# Altium project GEM_AVD_eFuse.PrjPcb (part 4 of 4)

## Sheet Mechanics.SchDoc: GEM AVD eFuse
size 420 x 297 mm; Author: G.Kasprowicz; CompanyName: WUT ISE; DrawnBy: G.Kasprowicz; Organization: WUT ISE; Address1: PW ISE; Address2: Nowowiejska 15/19 00-665 Warsaw; Address3: gkasprow@gmail.com; Revision: 2; SheetNumber: 5; SheetTotal: 6; ModifiedBy: -; CheckedDate: -; Title2: channel connectors; DivGrp: WUT ISE; Designer: G.Kasprowicz; ModifiedDate: -; ProjectName: Sensor Box
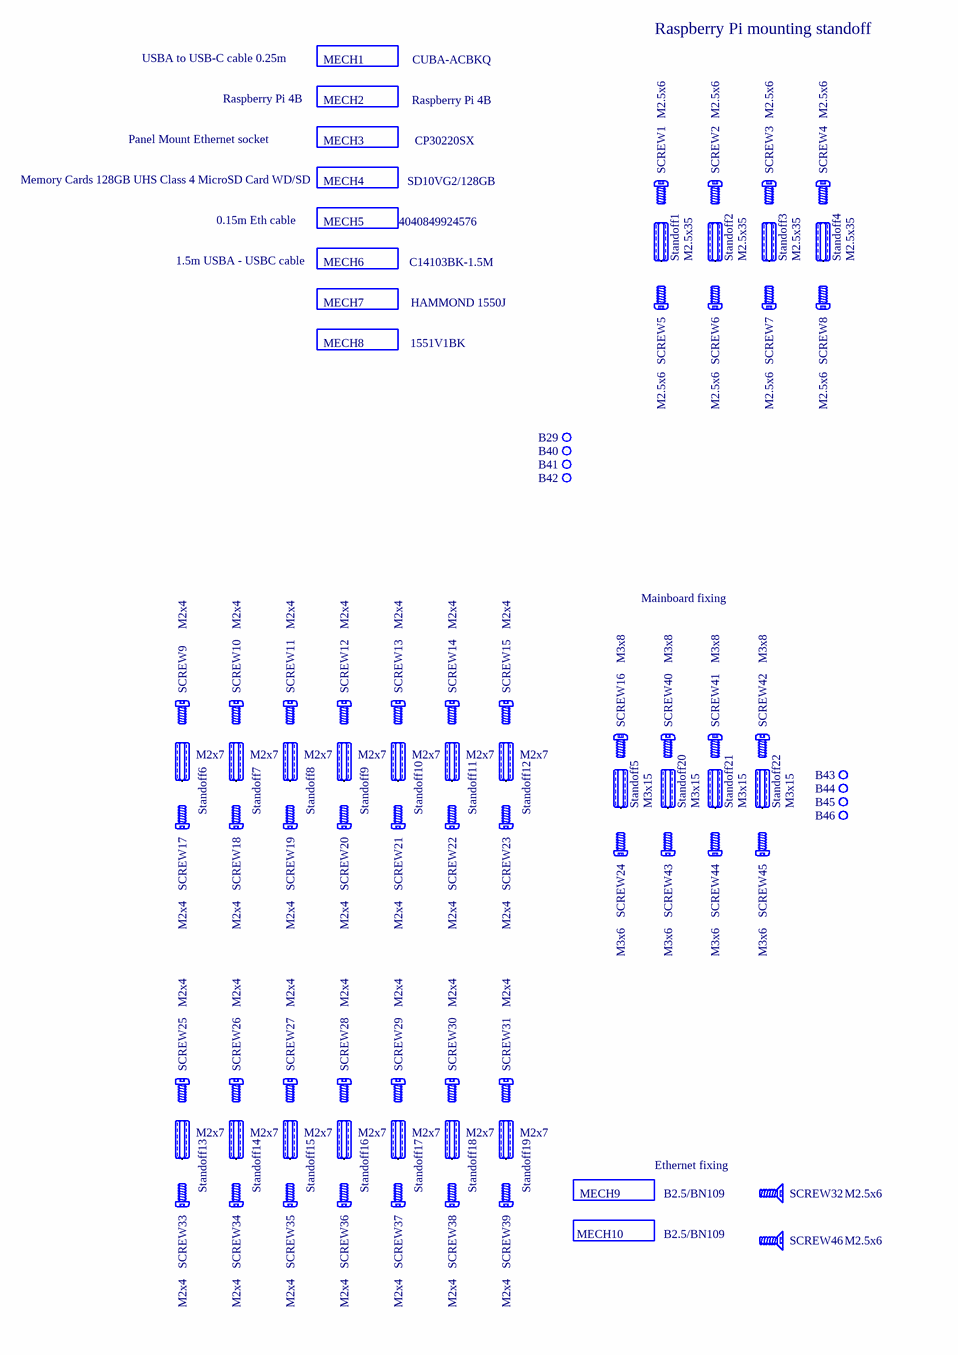
[diagram p4: Mechanics.SchDoc]

### Parts
B29  Plated Hole  [MTG300_600]  (value not drawn)  (no BOM)
B40  Plated Hole  [MTG300_600]  (value not drawn)  (no BOM)
B41  Plated Hole  [MTG300_600]  (value not drawn)  (no BOM)
B42  Plated Hole  [MTG300_600]  (value not drawn)  (no BOM)
B43  Plated Hole  [MTG320_550]  (value not drawn)  (no BOM)
B44  Plated Hole  [MTG320_550]  (value not drawn)  (no BOM)
B45  Plated Hole  [MTG320_550]  (value not drawn)  (no BOM)
B46  Plated Hole  [MTG320_550]  (value not drawn)  (no BOM)
MECH1  CUBA-ACBKQ  (mechanical)
MECH2  Raspberry Pi 4B  (mechanical)
MECH3  CP30220SX  (mechanical)
MECH4  SD10VG2/128GB  (mechanical)
MECH5  4040849924576  (mechanical)
MECH6  C14103BK-1.5M  (mechanical)
MECH7  HAMMOND 1550J  (mechanical)
MECH8  1551V1BK  (mechanical)
MECH9  B2.5/BN109  (mechanical)
MECH10  B2.5/BN109  (mechanical)
SCREW1  M2.5x6  [BOSSARD_BN9524-3271397_h]  (mechanical)
SCREW2  M2.5x6  [BOSSARD_BN9524-3271397_h]  (mechanical)
SCREW3  M2.5x6  [BOSSARD_BN9524-3271397_h]  (mechanical)
SCREW4  M2.5x6  [BOSSARD_BN9524-3271397_h]  (mechanical)
SCREW5  M2.5x6  [BOSSARD_BN9524-3271397_h]  (mechanical)
SCREW6  M2.5x6  [BOSSARD_BN9524-3271397_h]  (mechanical)
SCREW7  M2.5x6  [BOSSARD_BN9524-3271397_h]  (mechanical)
SCREW8  M2.5x6  [BOSSARD_BN9524-3271397_h]  (mechanical)
SCREW9  M2x4  [BOSSARD_BN9524-3271397_h]  (mechanical)
SCREW10  M2x4  [BOSSARD_BN9524-3271397_h]  (mechanical)
SCREW11  M2x4  [BOSSARD_BN9524-3271397_h]  (mechanical)
SCREW12  M2x4  [BOSSARD_BN9524-3271397_h]  (mechanical)
SCREW13  M2x4  [BOSSARD_BN9524-3271397_h]  (mechanical)
SCREW14  M2x4  [BOSSARD_BN9524-3271397_h]  (mechanical)
SCREW15  M2x4  [BOSSARD_BN9524-3271397_h]  (mechanical)
SCREW16  M3x8  [BOSSARD_BN9524-3271397_h]  (mechanical)
SCREW17  M2x4  [BOSSARD_BN9524-3271397_h]  (mechanical)
SCREW18  M2x4  [BOSSARD_BN9524-3271397_h]  (mechanical)
SCREW19  M2x4  [BOSSARD_BN9524-3271397_h]  (mechanical)
SCREW20  M2x4  [BOSSARD_BN9524-3271397_h]  (mechanical)
SCREW21  M2x4  [BOSSARD_BN9524-3271397_h]  (mechanical)
SCREW22  M2x4  [BOSSARD_BN9524-3271397_h]  (mechanical)
SCREW23  M2x4  [BOSSARD_BN9524-3271397_h]  (mechanical)
SCREW24  M3x6  [BOSSARD_BN9524-3271397_h]  (mechanical)
SCREW25  M2x4  [BOSSARD_BN9524-3271397_h]  (mechanical)
SCREW26  M2x4  [BOSSARD_BN9524-3271397_h]  (mechanical)
SCREW27  M2x4  [BOSSARD_BN9524-3271397_h]  (mechanical)
SCREW28  M2x4  [BOSSARD_BN9524-3271397_h]  (mechanical)
SCREW29  M2x4  [BOSSARD_BN9524-3271397_h]  (mechanical)
SCREW30  M2x4  [BOSSARD_BN9524-3271397_h]  (mechanical)
SCREW31  M2x4  [BOSSARD_BN9524-3271397_h]  (mechanical)
SCREW32  M2.5x6  [OSSARD_M3X8/BN3327_h]  (mechanical)
SCREW33  M2x4  [BOSSARD_BN9524-3271397_h]  (mechanical)
SCREW34  M2x4  [BOSSARD_BN9524-3271397_h]  (mechanical)
SCREW35  M2x4  [BOSSARD_BN9524-3271397_h]  (mechanical)
SCREW36  M2x4  [BOSSARD_BN9524-3271397_h]  (mechanical)
SCREW37  M2x4  [BOSSARD_BN9524-3271397_h]  (mechanical)
SCREW38  M2x4  [BOSSARD_BN9524-3271397_h]  (mechanical)
SCREW39  M2x4  [BOSSARD_BN9524-3271397_h]  (mechanical)
SCREW40  M3x8  [BOSSARD_BN9524-3271397_h]  (mechanical)
SCREW41  M3x8  [BOSSARD_BN9524-3271397_h]  (mechanical)
SCREW42  M3x8  [BOSSARD_BN9524-3271397_h]  (mechanical)
SCREW43  M3x6  [BOSSARD_BN9524-3271397_h]  (mechanical)
SCREW44  M3x6  [BOSSARD_BN9524-3271397_h]  (mechanical)
SCREW45  M3x6  [BOSSARD_BN9524-3271397_h]  (mechanical)
SCREW46  M2.5x6  [OSSARD_M3X8/BN3327_h]  (mechanical)
Standoff1  M2.5x35  [BOSSARD_BN3320-1382721]  (mechanical)
Standoff2  M2.5x35  [BOSSARD_BN3320-1382721]  (mechanical)
Standoff3  M2.5x35  [BOSSARD_BN3320-1382721]  (mechanical)
Standoff4  M2.5x35  [BOSSARD_BN3320-1382721]  (mechanical)
Standoff5  M3x15  [BOSSARD_BN3320-1382721]  (mechanical)
Standoff6  M2x7  [BOSSARD_BN3320-1382721]  (mechanical)
Standoff7  M2x7  [BOSSARD_BN3320-1382721]  (mechanical)
Standoff8  M2x7  [BOSSARD_BN3320-1382721]  (mechanical)
Standoff9  M2x7  [BOSSARD_BN3320-1382721]  (mechanical)
Standoff10  M2x7  [BOSSARD_BN3320-1382721]  (mechanical)
Standoff11  M2x7  [BOSSARD_BN3320-1382721]  (mechanical)
Standoff12  M2x7  [BOSSARD_BN3320-1382721]  (mechanical)
Standoff13  M2x7  [BOSSARD_BN3320-1382721]  (mechanical)
Standoff14  M2x7  [BOSSARD_BN3320-1382721]  (mechanical)
Standoff15  M2x7  [BOSSARD_BN3320-1382721]  (mechanical)
Standoff16  M2x7  [BOSSARD_BN3320-1382721]  (mechanical)
Standoff17  M2x7  [BOSSARD_BN3320-1382721]  (mechanical)
Standoff18  M2x7  [BOSSARD_BN3320-1382721]  (mechanical)
Standoff19  M2x7  [BOSSARD_BN3320-1382721]  (mechanical)
Standoff20  M3x15  [BOSSARD_BN3320-1382721]  (mechanical)
Standoff21  M3x15  [BOSSARD_BN3320-1382721]  (mechanical)
Standoff22  M3x15  [BOSSARD_BN3320-1382721]  (mechanical)

### Nets

Not connected (* = marked no-connect by the designer): B29 1; B40 1; B41 1; B42 1; B43 1; B44 1; B45 1; B46 1; Standoff1 1; Standoff2 1; Standoff3 1; Standoff4 1; Standoff5 1; Standoff6 1; Standoff7 1; Standoff8 1; Standoff9 1; Standoff10 1; Standoff11 1; Standoff12 1; Standoff13 1; Standoff14 1; Standoff15 1; Standoff16 1; Standoff17 1; Standoff18 1; Standoff19 1; Standoff20 1; Standoff21 1; Standoff22 1

### Notes on the sheet
- Raspberry Pi mounting standoff
- Mainboard fixing
- Ethernet fixing
- Project/Equipment
- Document
- Designer
- Drawn by
- Check.by
- Copyright WUT ISE 2020.
  This documentation describes Open Hardware and is licensed under the CERN OHL v.1.2. You may redistribute and modify this documentation under the terms of the CERN OHL v.1.2. (http://ohwr.org/CERNOHL). This documentation is distributed WITHOUT ANY EXPRESS OR IMPLIED WARRANTY, INCLUDING OF MERCHANTABILITY, SATISFACTORY QUALITY AND FITNESS FOR A PARTICULAR PURPOSE. Please see the CERN OHL v.1.2 for applicable conditions.
- Contact
- File
- Last Mod.
- Print Date
- Sheet
- Size
- A3
- of
- Rev

### Library data of the parts
B29 B40-B42 = PLATED_HOLE3.0_PAD6.0: Single Terminal Socket; Part Description: Plated Through Hole: Hole Dia.=3.0mm Pad Dia.=6.0mm; Mounted: No; Part Number: PLATED_HOLE3.0_PAD6.0; Component Type: Standard (No BOM); Pin Count: 1; Family: Plated Hole; Socket: No; SMD: No; Sense: No; Status: None; ComponentHeight: 0mm; HelpURL: Undefined; Author: CERN DEM JLC; CreateDate: 26.05.2008; LatestRevisionDate: 26.05.2008; PackageDescription: Plated Through Hole: Hole Dia.=3.0mm Pad Dia.=6.0mm
B43-B46 = PLATED_HOLE3.2_PAD5.5: Single Terminal Socket; Part Description: Plated Through Hole: Hole Dia.=3.2mm Pad Dia.=5.5mm; Mounted: No; Part Number: PLATED_HOLE3.2_PAD5.5; Component Type: Standard (No BOM); Pin Count: 1; Family: Plated Hole; Socket: No; SMD: No; Sense: No; Status: None; ComponentHeight: 0mm; HelpURL: Undefined; Author: CERN DEM JMW; CreateDate: 01.10.2012; LatestRevisionDate: 01.10.2012; PackageDescription: Plated Through Hole: Hole Dia.=3.2mm Pad Dia.=5.5mm
MECH1 = Generic_mechanical: USBA to USB-C cable 0.25m; Manufacturer: Lanberg; PressFit: No; Part Number: CUBA-ACBKQ; Component Type: Standard; Footprint: generic_MECH; Pin Count: 0; PackageDescription: generic; Mounted: Yes; Socket: No; SMD: No; Sense: No; Status: None; Part Description: USBA to USB-C cable 0.25m; Manufacturer Part Number: CUBA-ACBKQ; ComponentHeight: generic; Author: FS; CreateDate: 28.10.2019; LatestRevisionDate: 28.10.2019
MECH2 MECH7 = Generic_mechanical: PressFit: No; Component Type: Standard; Footprint: generic_MECH; Pin Count: 0; PackageDescription: generic; Mounted: Yes; Socket: No; SMD: No; Sense: No; Status: None; ComponentHeight: generic; CreateDate: 28.10.2019; LatestRevisionDate: 28.10.2019
  MECH2: Part Number: Raspberry Pi 4B; Part Description: Raspberry Pi 4B; Manufacturer: Raspberry Pi 4B; Manufacturer Part Number: Raspberry Pi 4B; Author: FS
  MECH7: Part Number: HAMMOND 1550J; Part Description: HAMMOND 1550J; Manufacturer: HAMMOND; Manufacturer Part Number: HAMMOND 1550J; Author: GK
MECH3 = Generic_mechanical: Panel Mount Ethernet socket; Manufacturer: CLIFF; PressFit: No; Part Number: CP30220SX; Component Type: Standard; Footprint: generic_MECH; Pin Count: 0; PackageDescription: generic; Mounted: Yes; Socket: No; SMD: No; Sense: No; Status: None; Part Description: Panel Mount Ethernet socket; Manufacturer Part Number: CP30220SX; ComponentHeight: generic; Author: FS; CreateDate: 28.10.2019; LatestRevisionDate: 28.10.2019
MECH4 = Generic_mechanical: Memory Cards 128GB UHS Class 4 MicroSD Card WD/SD; Manufacturer: Kingston; PressFit: No; Part Number: SD10VG2/128GB; Component Type: Standard; Footprint: generic_MECH; Pin Count: 0; PackageDescription: generic; Mounted: Yes; Socket: No; SMD: No; Sense: No; Status: None; Part Description: Memory Cards 128GB UHS Class 4 MicroSD Card WD/SD; Manufacturer Part Number: SD10VG2/128GB; ComponentHeight: generic; Author: FS; CreateDate: 28.10.2019; LatestRevisionDate: 28.10.2019
MECH5 = Generic_mechanical: 0.15m Eth cable; Manufacturer: Goobay; PressFit: No; Part Number: 4040849924576; Component Type: Standard; Footprint: generic_MECH; Pin Count: 0; PackageDescription: generic; Mounted: Yes; Socket: No; SMD: No; Sense: No; Status: None; Part Description: 0.15m Eth cable; Manufacturer Part Number: 4040849924576; ComponentHeight: generic; Author: FS; CreateDate: 28.10.2019; LatestRevisionDate: 28.10.2019
MECH6 = Generic_mechanical: 1.5m USBA - USBC cable; Manufacturer: Unitek; PressFit: No; Part Number: C14103BK-1.5M; Component Type: Standard; Footprint: generic_MECH; Pin Count: 0; PackageDescription: generic; Mounted: Yes; Socket: No; SMD: No; Sense: No; Status: None; Part Description: 1.5m USBA - USBC cable; Manufacturer Part Number: C14103BK-1.5M; ComponentHeight: generic; Author: FS; CreateDate: 28.10.2019; LatestRevisionDate: 28.10.2019
MECH8 = Generic_mechanical: Manufacturer: Hammond; PressFit: No; Value: 750mm; Part Number: 1551V1BK; Component Type: Standard; Footprint: generic_MECH; Pin Count: 0; PackageDescription: generic; Mounted: Yes; Socket: No; SMD: No; Sense: No; Status: None; Part Description: 1551V1BK; Manufacturer Part Number: 1551V1BK; ComponentHeight: generic; Author: GK; CreateDate: 28.10.2019; LatestRevisionDate: 28.10.2019
MECH9 MECH10 = Generic_mechanical: M2.5 NUT; Manufacturer: Bosard; PressFit: No; Value: 750mm; Part Number: B2.5/BN109; Component Type: Standard; Footprint: generic_MECH; Pin Count: 0; PackageDescription: generic; Mounted: Yes; Socket: No; SMD: No; Sense: No; Status: None; Part Description: B2.5/BN109; Manufacturer Part Number: B2.5/BN109; ComponentHeight: generic; Author: GK; CreateDate: 28.10.2019; LatestRevisionDate: 28.10.2019
SCREW1-SCREW8 = BOSSARD_BN9524-3271397_h: Screw; Part Number: 8G206M2X04; Part Description: M2.5 L=6mm; Manufacturer: DREMEC; Manufacturer Part Number: DR8G201M2.5X6; PressFit: No; Component Type: Mechanical; Pin Count: 0; PackageDescription: M2.5 L=6mm; Mounted: Yes; Socket: No; SMD: No; Sense: No; Status: None; Value: M2.5x6; ComponentHeight: 6mm; HelpURL: \\cern.ch\dfs\Applications\Altium\Datasheets\BOSSARD_BN9524-3271397.pdf; Author: CERN DEM JLC; CreateDate: 11.03.2019; LatestRevisionDate: 11.03.2019
SCREW9-SCREW15 SCREW17-SCREW23 SCREW25-SCREW31 SCREW33-SCREW39 = BOSSARD_BN9524-3271397_h: Screw; Part Number: 8G206M2X04; Part Description: M2 L=4mm; Manufacturer: DREMEC; PressFit: No; Component Type: Mechanical; Pin Count: 0; PackageDescription: M2 L=4mm; Mounted: Yes; Socket: No; SMD: No; Sense: No; Status: None; Value: M2x4; Manufacturer Part Number: 8G206M2X04; ComponentHeight: 6mm; HelpURL: \\cern.ch\dfs\Applications\Altium\Datasheets\BOSSARD_BN9524-3271397.pdf; Author: CERN DEM JLC; CreateDate: 11.03.2019; LatestRevisionDate: 11.03.2019
SCREW16 SCREW40-SCREW42 = BOSSARD_BN9524-3271397_h: Screw M3 poiliamid 8mm; Part Number: DR8G201M3X8; Part Description: M3 L=8mm; Manufacturer: DREMEC; PressFit: No; Component Type: Mechanical; Pin Count: 0; PackageDescription: M3 L=8mm; Mounted: Yes; Socket: No; SMD: No; Sense: No; Status: None; Value: M3x8; Manufacturer Part Number: DR8G201M3X8; ComponentHeight: 8; HelpURL: \\cern.ch\dfs\Applications\Altium\Datasheets\BOSSARD_BN9524-3271397.pdf; Author: CERN DEM JLC; CreateDate: 11.03.2019; LatestRevisionDate: 11.03.2019
SCREW24 SCREW43-SCREW45 = BOSSARD_BN9524-3271397_h: Screw M3 countersink 6mm; Part Number: B3X6/BN388; Part Description: M3 L=6mm; Manufacturer: DREMEC; PressFit: No; Component Type: Mechanical; Pin Count: 0; PackageDescription: M3 L=6mm; Mounted: Yes; Socket: No; SMD: No; Sense: No; Status: None; Value: M3x6; Manufacturer Part Number: B3X6/BN388; ComponentHeight: 6mm; HelpURL: \\cern.ch\dfs\Applications\Altium\Datasheets\BOSSARD_BN9524-3271397.pdf; Author: CERN DEM JLC; CreateDate: 11.03.2019; LatestRevisionDate: 11.03.2019
SCREW32 SCREW46 = OSSARD_M3X8/BN3327: Screw; 3x8; Head: countersunk; Pozidriv; A2 stainless steel; Part Number: B2.5X6/BN388; Part Description: M2.5 L=6mm  countersunk; Pozidriv Pan Head Screw, Fully Threaded, Stainless Steel A2; Manufacturer: BOSSARD; PressFit: No; Component Type: Mechanical; Pin Count: 0; PackageDescription: M2.5 L=6mm Countersunk Posidriv Screw, Fully Threaded - Stainless Steel A2; Mounted: Yes; Socket: No; SMD: No; Sense: No; Status: None; Value: M2.5x6; Manufacturer Part Number: B2.5X6/BN388; ComponentHeight: 5.6mm; HelpURL: \\cern.ch\dfs\Applications\Altium\Datasheets\BOSSARD_BN5687-3061605.pdf; Author: GK; CreateDate: 15/01/2013; LatestRevisionDate: 15/01/2013
Standoff1-Standoff4 = BOSSARD_BN3320-1382721: Standoff Female-Female 15mm; Part Number: TFF-M2.5X35/DR182; Part Description: M2.5 L=35mm, Hex Stand-Off; Manufacturer: DREMEC; PressFit: No; Component Type: Mechanical; Footprint: BOSSARD_BN3320-1544624; Pin Count: 1; PackageDescription: M2.5 L=35mm, Hex Stand-Off with Internal Thread; Mounted: Yes; Socket: No; SMD: No; Sense: No; Status: None; Value: M2.5x35; Manufacturer Part Number: TFF-M2.5X35/DR182; ComponentHeight: 35mm; HelpURL: \\cern.ch\dfs\Applications\Altium\Datasheets\BOSSARD_BN3320-1382721.pdf; Author: CERN DEM BC; CreateDate: 25.09.2020; LatestRevisionDate: 25.09.2020
Standoff5 Standoff20-Standoff22 = BOSSARD_BN3320-1382721: Standoff Female-Female 15mm; Part Number: R30-1611500; Part Description: M3 L=15mm, Hex Stand-Off; Manufacturer: HARWIN; PressFit: No; Component Type: Mechanical; Footprint: BOSSARD_BN3320-1544624; Pin Count: 1; PackageDescription: M3 L=15mm, Hex Stand-Off with Internal Thread; Mounted: Yes; Socket: No; SMD: No; Sense: No; Status: None; Value: M3x15; Manufacturer Part Number: R30-1611500; ComponentHeight: 15mm; HelpURL: \\cern.ch\dfs\Applications\Altium\Datasheets\BOSSARD_BN3320-1382721.pdf; Author: CERN DEM BC; CreateDate: 25.09.2020; LatestRevisionDate: 25.09.2020
Standoff6-Standoff19 = BOSSARD_BN3320-1382721: Standoff Female-Female; Part Number: FIX-HP2-7; Part Description: M2 L=7mm; PressFit: No; Component Type: Mechanical; Pin Count: 1; PackageDescription: M2 L=17mm; Mounted: Yes; Socket: No; SMD: No; Sense: No; Status: None; Value: M2x7; Manufacturer: BOSSARD; Manufacturer Part Number: FIX-HP2-7; ComponentHeight: 12mm; HelpURL: \\cern.ch\dfs\Applications\Altium\Datasheets\BOSSARD_BN3320-1382721.pdf; Author: CERN DEM BC; CreateDate: 25.09.2020; LatestRevisionDate: 25.09.2020

## Sheet Divider.SchDoc: GEM AVD eFuse
size 420 x 297 mm; Author: G.Kasprowicz; CompanyName: WUT ISE; DrawnBy: G.Kasprowicz; Organization: WUT ISE; Address1: PW ISE; Address2: Nowowiejska 15/19 00-665 Warsaw; Address3: gkasprow@gmail.com; Revision: 2; SheetNumber: 6; SheetTotal: 6; ModifiedBy: -; CheckedDate: -; Title2: channel connectors; DivGrp: WUT ISE; Designer: G.Kasprowicz; ModifiedDate: -; ProjectName: Sensor Box
Used 2 times, as channels U_Divider, U_Divider. Parts and nets are listed once, with the designators drawn on the sheet.
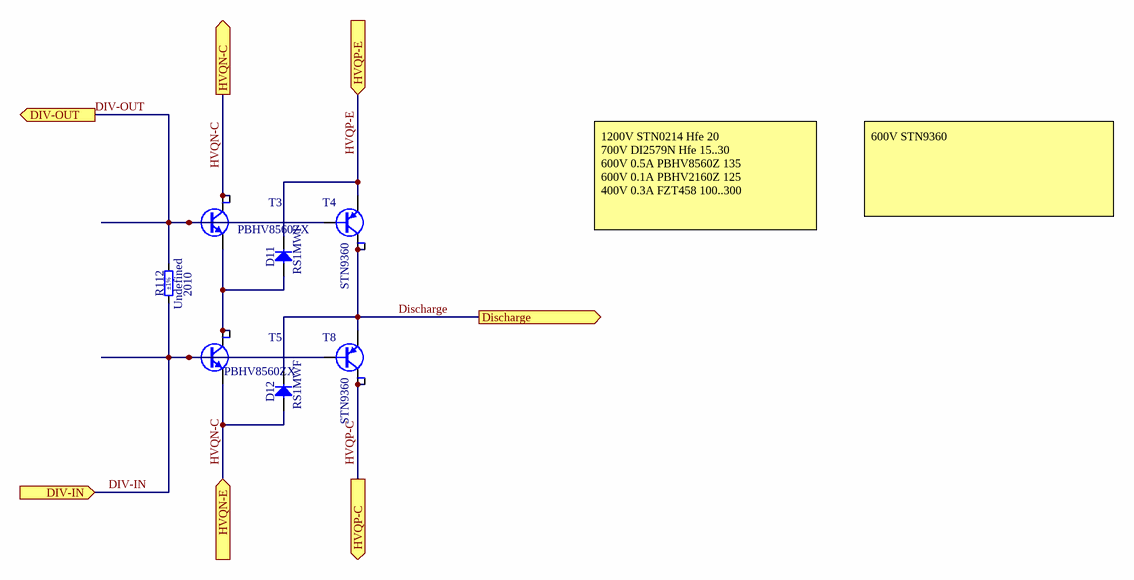
[diagram p5: Divider.SchDoc]

### Parts
D11  RS1MWF  [SOD-123F]
D12  RS1MWF  [SOD-123F]
R112  Undefined  Tolerance: ±1%  Case: 2010  [RES_VISHAY_CRHV2010A]
T3  PBHV8560ZX  [SOT230P700X180-4N]
T4  STN9360  [SOT230P700X180-4N]
T5  PBHV8560ZX  [SOT230P700X180-4N]
T8  STN9360  [SOT230P700X180-4N]

### Ports
Discharge (out, see GEM_AVD_eFuse[3E]), DIV-IN (in, see GEM_AVD_eFuse[3D]), DIV-OUT (out, see GEM_AVD_eFuse[3D]), HVQN-C (out, see GEM_AVD_eFuse[3E]), HVQN-E (in, see GEM_AVD_eFuse[3D]), HVQP-C (out, see GEM_AVD_eFuse[3D]), HVQP-E (in, see GEM_AVD_eFuse[3E])

### Nets
Discharge: D12.1(C) T4.2(C) T4.4(C) T8.3(E) ; port Discharge
DIV-IN: R112.1 T5.1(B) T8.1(B) ; port DIV-IN
DIV-OUT: R112.2 T3.1(B) T4.1(B) ; port DIV-OUT
HVQN-C: D12.2(A) T3.2(C) T3.4(C) T5.3(E) ; port HVQN-C, port HVQN-E
HVQP-C: T8.2(C) T8.4(C) ; port HVQP-C
HVQP-E: D11.1(C) T4.3(E) ; port HVQP-E
NetD11_2: D11.2(A) T3.3(E) T5.2(C) T5.4(C)

### Channels
U_Divider: designators end in A; ports Discharge=Discharge_U_Divider DIV-IN=DIV-IN DIV-OUT=DIV-OUT HVQN-C=HVQN-C HVQN-E=HVQN-C HVQP-C=HVQP-C HVQP-E=HVQP-E
U_Divider: designators end in B; ports Discharge=Discharge DIV-IN=DIV-IN DIV-OUT=DIV-OUT HVQN-C=HVQN-C HVQN-E=HVQN-C HVQP-C=HVQP-C HVQP-E=HVQP-E

### Notes on the sheet
- 1200V STN0214 Hfe 20
  700V DI2579N Hfe 15..30
  600V 0.5A PBHV8560Z 135
  600V 0.1A PBHV2160Z 125
  400V 0.3A FZT458 100..300
- 600V STN9360
- Project/Equipment
- Document
- Designer
- Drawn by
- Check.by
- Copyright WUT ISE 2020.
  This documentation describes Open Hardware and is licensed under the CERN OHL v.1.2. You may redistribute and modify this documentation under the terms of the CERN OHL v.1.2. (http://ohwr.org/CERNOHL). This documentation is distributed WITHOUT ANY EXPRESS OR IMPLIED WARRANTY, INCLUDING OF MERCHANTABILITY, SATISFACTORY QUALITY AND FITNESS FOR A PARTICULAR PURPOSE. Please see the CERN OHL v.1.2 for applicable conditions.
- Contact
- File
- Last Mod.
- Print Date
- Sheet
- Size
- A3
- of
- Rev

### Library data of the parts
D11 D12 = RS1MWF: Diode; Part Description: High Voltage Fast Recover Rectifier; Manufacturer: DIODES INCORPORATED; Voltage: 1000V; Power: 1A; PressFit: No; Bonding: No; Part Number: RS1MWF; Component Kind: Standard; Component Type: Standard; Device: RS1MWF; PackageDescription: SODF (SOD-123F) Diode; 1.80mm W X 0.3.50mm L X 1.15mm H body, IPC Medium Density; Manufacturer Part Number: RS1MWF; Pin Count: 2; Case: SOD123F; Mounted: Yes; Socket: No; SMD: Yes; Sense: No; ComponentHeight: 1.15mm; HelpURL: \\cern.ch\dfs\Applications\Altium\Datasheets\RS1MWF.pdf; Author: CERN DEM HF; CreateDate: 29.02.2024; LatestRevisionDate: 29.02.2024
R112 = R2010_1G_1%_0.5W_100PPM_VISHAY_CRHV2010AF1G00FKET: Resistor - 1%; Manufacturer: VISHAY TECHNO; Power: 0.5W; TC: ±100ppm/°C; PressFit: No; Part Number: Undefined; Component Kind: Standard; Component Type: Standard; Pin Count: 2; Value: Undefined; Status: None; Part Description: Undefined; Manufacturer Part Number: Undefined; Mounted: Yes; Sense: No; Socket: No; SMD: Yes; ComponentHeight: 0.68mm; HelpURL: \\cern.ch\dfs\Applications\Altium\Datasheets\R2010_VISHAY_CRHV.pdf; Author: CERN DEM JLC; CreateDate: 03.06.2015; LatestRevisionDate: 03.06.2015
T3 T5 = Q_PBHV8560Z: 600 V, 0.5 A NPN high-voltage low VCEsat (BISS) transistor; Part Description: 600V 500mA NPN High Voltage Transistor; Manufacturer: Nexperia; PressFit: No; Bonding: No; Part Number: PBHV8560ZX; Component Kind: Standard; Component Type: Standard; Device: PBHV8560ZX; PackageDescription: SOT223, 2.30mm Pitch; 4 Pin, 3.70mm W X 6.70mm L X 1.80mm H body, IPC Medium Density; Manufacturer Part Number: PBHV8560ZX; Pin Count: 4; Case: SOT223; Mounted: Yes; Socket: No; SMD: Yes; Sense: No; ComponentHeight: 1.8mm; HelpURL: \\cern.ch\dfs\Applications\Altium\Datasheets\FZT458TA.pdf; Author: GK; CreateDate: 15.06.2011; LatestRevisionDate: 15.06.2011
T4 T8 = STN9360: PNP Transistor; Part Description: 250V 100mA PNP High-Voltage Transistors; Manufacturer: STMicroelectronics; PressFit: No; Bonding: No; Part Number: STN9360; Component Kind: Standard; Component Type: Standard; Device: STN9360; PackageDescription: SOT223, 2.30mm Pitch; 4 Pin, 3.70mm W X 6.70mm L X 1.80mm H body, IPC Medium Density; Manufacturer Part Number: STN9360; Pin Count: 4; Case: SOT223; Mounted: Yes; Socket: No; SMD: Yes; Sense: No; ComponentHeight: 1.8mm; HelpURL: \\cern.ch\dfs\Applications\Altium\Datasheets\BF723,115.pdf; Author: FS; CreateDate: 15.06.2011; LatestRevisionDate: 15.06.2011

## Nets that join several sheets
GND: GEM_AVD_eFuse (10 pins), U_HV_channel0 (J6A.32), U_HV_channel1 (J6B.32), U_HV_channel2 (J6C.32), U_HV_channel3 (J6D.32), U_HV_channel4 (J6E.32), U_HV_channel5 (J6F.32), U_HV_channel6 (J6G.32), AVD_eFuse_LV_Supply (55 pins), AVD_eFuse_HV_Ctrl (60 pins)
N1V8: AVD_eFuse_LV_Supply (B49.1 C39.2 IC4.5), AVD_eFuse_HV_Ctrl (C41.1 IC3.11)
P3V3: GEM_AVD_eFuse (R29.2), AVD_eFuse_LV_Supply (9 pins), AVD_eFuse_HV_Ctrl (29 pins)
P5V: AVD_eFuse_LV_Supply (C31.2 D10.1 IC16.3), AVD_eFuse_HV_Ctrl (J13.4)
P5V0: GEM_AVD_eFuse (R120.2), AVD_eFuse_LV_Supply (27 pins), AVD_eFuse_HV_Ctrl (R96.1)
P5V0_OUT: U_HV_channel0 (J6A.31), U_HV_channel1 (J6B.31), U_HV_channel2 (J6C.31), U_HV_channel3 (J6D.31), U_HV_channel4 (J6E.31), U_HV_channel5 (J6F.31), U_HV_channel6 (J6G.31), AVD_eFuse_HV_Ctrl (R72.2 R74.2)
P5V0A: AVD_eFuse_LV_Supply (5 pins), AVD_eFuse_HV_Ctrl (7 pins)
P12V0: AVD_eFuse_LV_Supply (26 pins), AVD_eFuse_HV_Ctrl (R94.1)
Discharge: GEM_AVD_eFuse (R119.2), U_Divider (D12B.1 T4B.2 T4B.4 T8B.3)
DIV-IN: GEM_AVD_eFuse (C42.1 P9.2 R117.2), U_Divider (R112B.1 T5B.1 T8B.1)
DIV-IN: GEM_AVD_eFuse (R110.1), U_Divider (R112A.1 T5A.1 T8A.1)
DIV-OUT: GEM_AVD_eFuse (R92.1), U_Divider (R112B.2 T3B.1 T4B.1)
DIV-OUT: GEM_AVD_eFuse (R113.2), U_Divider (R112A.2 T3A.1 T4A.1)
DIV_IN: GEM_AVD_eFuse (C7.1 P2.2 R24.2), U_HV_channel1 (J6B.16)
DIV_IN: GEM_AVD_eFuse (C8.1 P3.2 R34.2), U_HV_channel2 (J6C.16)
DIV_IN: GEM_AVD_eFuse (C9.1 P4.2 R38.2), U_HV_channel3 (J6D.16)
DIV_IN: GEM_AVD_eFuse (C16.1 P5.2 R42.2), U_HV_channel4 (J6E.16)
DIV_IN: GEM_AVD_eFuse (C17.1 P6.2 R68.2), U_HV_channel5 (J6F.16)
DIV_IN: GEM_AVD_eFuse (C18.1 P7.2 R83.2), U_HV_channel6 (J6G.16)
DIV_IN: GEM_AVD_eFuse (R113.1), U_HV_channel0 (J6A.16)
DIV_OUT: GEM_AVD_eFuse (C7.2 R16.1), U_HV_channel0 (J6A.19)
DIV_OUT: GEM_AVD_eFuse (C8.2 R18.1), U_HV_channel1 (J6B.19)
DIV_OUT: GEM_AVD_eFuse (C9.2 R20.1), U_HV_channel2 (J6C.19)
DIV_OUT: GEM_AVD_eFuse (C16.2 R22.1), U_HV_channel3 (J6D.19)
DIV_OUT: GEM_AVD_eFuse (C17.2 R23.1), U_HV_channel4 (J6E.19)
DIV_OUT: GEM_AVD_eFuse (C18.2 R25.1), U_HV_channel5 (J6F.19)
DIV_OUT: GEM_AVD_eFuse (C42.2 R91.1), U_HV_channel6 (J6G.19)
GEM_O0: GEM_AVD_eFuse (B1.1), U_HV_channel0 (J6A.1)
GEM_O0: GEM_AVD_eFuse (B5.1), U_HV_channel1 (J6B.1)
GEM_O0: GEM_AVD_eFuse (B9.1), U_HV_channel2 (J6C.1)
GEM_O0: GEM_AVD_eFuse (B13.1), U_HV_channel3 (J6D.1)
GEM_O0: GEM_AVD_eFuse (B17.1), U_HV_channel4 (J6E.1)
GEM_O0: GEM_AVD_eFuse (B21.1), U_HV_channel5 (J6F.1)
GEM_O0: GEM_AVD_eFuse (B25.1), U_HV_channel6 (J6G.1)
GEM_O1: GEM_AVD_eFuse (B2.1), U_HV_channel0 (J6A.3)
GEM_O1: GEM_AVD_eFuse (B6.1), U_HV_channel1 (J6B.3)
GEM_O1: GEM_AVD_eFuse (B10.1), U_HV_channel2 (J6C.3)
GEM_O1: GEM_AVD_eFuse (B14.1), U_HV_channel3 (J6D.3)
GEM_O1: GEM_AVD_eFuse (B18.1), U_HV_channel4 (J6E.3)
GEM_O1: GEM_AVD_eFuse (B22.1), U_HV_channel5 (J6F.3)
GEM_O1: GEM_AVD_eFuse (B26.1), U_HV_channel6 (J6G.3)
GEM_O2: GEM_AVD_eFuse (B3.1), U_HV_channel0 (J6A.2)
GEM_O2: GEM_AVD_eFuse (B7.1), U_HV_channel1 (J6B.2)
GEM_O2: GEM_AVD_eFuse (B11.1), U_HV_channel2 (J6C.2)
GEM_O2: GEM_AVD_eFuse (B15.1), U_HV_channel3 (J6D.2)
GEM_O2: GEM_AVD_eFuse (B19.1), U_HV_channel4 (J6E.2)
GEM_O2: GEM_AVD_eFuse (B23.1), U_HV_channel5 (J6F.2)
GEM_O2: GEM_AVD_eFuse (B27.1), U_HV_channel6 (J6G.2)
GEM_O3: GEM_AVD_eFuse (B4.1), U_HV_channel0 (J6A.4)
GEM_O3: GEM_AVD_eFuse (B8.1), U_HV_channel1 (J6B.4)
GEM_O3: GEM_AVD_eFuse (B12.1), U_HV_channel2 (J6C.4)
GEM_O3: GEM_AVD_eFuse (B16.1), U_HV_channel3 (J6D.4)
GEM_O3: GEM_AVD_eFuse (B20.1), U_HV_channel4 (J6E.4)
GEM_O3: GEM_AVD_eFuse (B24.1), U_HV_channel5 (J6F.4)
GEM_O3: GEM_AVD_eFuse (B28.1), U_HV_channel6 (J6G.4)
HV_ON: GEM_AVD_eFuse (T10.1), AVD_eFuse_HV_Ctrl (5 pins)
HV_OUT: GEM_AVD_eFuse (R62.1 R63.1 TP2.1), AVD_eFuse_HV_Ctrl (5 pins)
HVQN-C: GEM_AVD_eFuse (T7.2 T7.4), U_HV_channel0 (J6A.22), U_Divider (D12A.2 T3A.2 T3A.4 T5A.3)
HVQN-C: GEM_AVD_eFuse (D1.1 D4.2), U_HV_channel6 (J6G.15), AVD_eFuse_HV_Ctrl (IC3.6 R80.1), U_Divider (D12B.2 T3B.2 T3B.4 T5B.3)
HVQN_C: U_HV_channel0 (J6A.15), U_HV_channel1 (J6B.22)
HVQN_C: U_HV_channel1 (J6B.15), U_HV_channel2 (J6C.22)
HVQN_C: U_HV_channel2 (J6C.15), U_HV_channel3 (J6D.22)
HVQN_C: U_HV_channel3 (J6D.15), U_HV_channel4 (J6E.22)
HVQN_C: U_HV_channel4 (J6E.15), U_HV_channel5 (J6F.22)
HVQN_C: U_HV_channel5 (J6F.15), U_HV_channel6 (J6G.22)
HVQP-C: GEM_AVD_eFuse (R61.2 R110.2), U_Divider (T8A.2 T8A.4)
HVQP-C: U_HV_channel6 (J6G.8), U_Divider (T8B.2 T8B.4)
HVQP-E: GEM_AVD_eFuse (T2.2 T2.4), U_Divider (D11B.1 T4B.3)
HVQP-E: U_HV_channel0 (J6A.12), U_Divider (D11A.1 T4A.3)
HVQP_C: U_HV_channel0 (J6A.8), U_HV_channel1 (J6B.12)
HVQP_C: U_HV_channel1 (J6B.8), U_HV_channel2 (J6C.12)
HVQP_C: U_HV_channel2 (J6C.8), U_HV_channel3 (J6D.12)
HVQP_C: U_HV_channel3 (J6D.8), U_HV_channel4 (J6E.12)
HVQP_C: U_HV_channel4 (J6E.8), U_HV_channel5 (J6F.12)
HVQP_C: U_HV_channel5 (J6F.8), U_HV_channel6 (J6G.12)
Imeas_P: GEM_AVD_eFuse (D5.1 D6.2 R101.2 TP5.1), AVD_eFuse_HV_Ctrl (IC3.2 R77.1)
INTERLOCK: GEM_AVD_eFuse (D3.1 J8.1 R29.1), AVD_eFuse_HV_Ctrl (IC25.2)
PG_OUT: GEM_AVD_eFuse (J9.1), AVD_eFuse_HV_Ctrl (IC23.3)
PGOOD: AVD_eFuse_LV_Supply (IC15.58 R53.1), AVD_eFuse_HV_Ctrl (IC23.5)